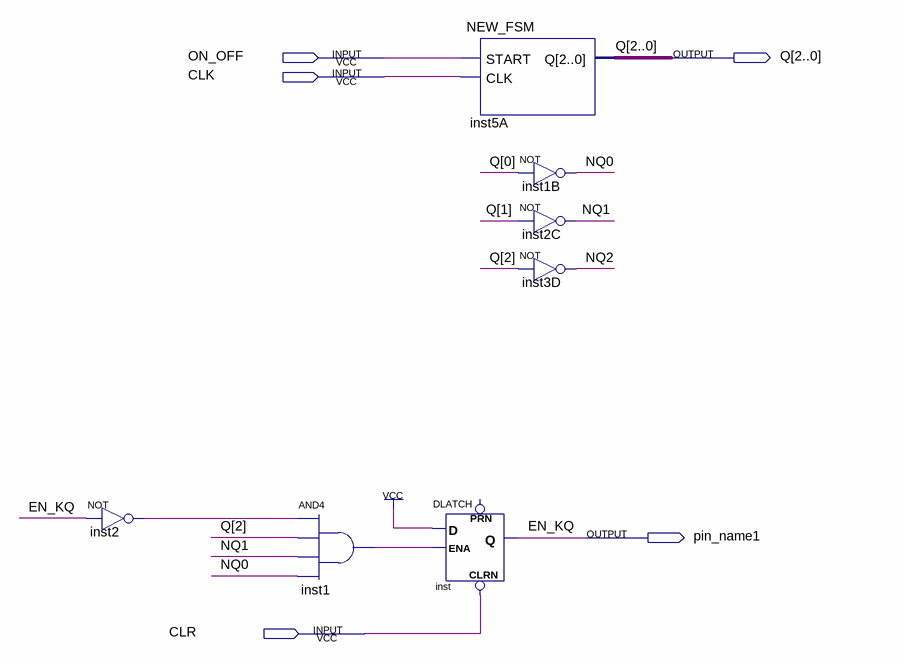
[diagram p0: schematic sheet]
// Quartus schematic TEST.bdf as structural Verilog: 7 symbols, 5 pins
module TEST (
  input  ON_OFF,
  input  CLK,
  input  CLR,
  output [2:0] Q,
  output pin_name1
);

  wire inst1_out, inst2_out, NQ0, NQ1, NQ2;

  not inst2 (inst2_out, pin_name1);
  and inst1 (inst1_out, inst2_out, Q[2], NQ1, NQ0);
  NEW_FSM inst5A (.START(ON_OFF), .CLK(CLK), .Q(Q));
  DLATCH inst (.CLRN(CLR), .D(1'b1), .ENA(inst1_out), .Q(pin_name1));  // open: PRN
  not inst1B (NQ0, Q[0]);
  not inst2C (NQ1, Q[1]);
  not inst3D (NQ2, Q[2]);

  // Other names for the same wires on the sheet: EN_KQ = pin_name1
endmodule
